# EasyEDA Pro project 小方开源v1.0(硬件设计佳立创EDA专业版).epro

# Schematic 小方-type-c-328p_开源
Create Date: 2023-09-03; Page Name: 小方开源; Project Name: 小方开源; Schematic Name: 小方-type-c-328p_开源; Update Date: 2023-09-03; Company: 嘉立创EDA; Page Size: A4; Version: V1.0
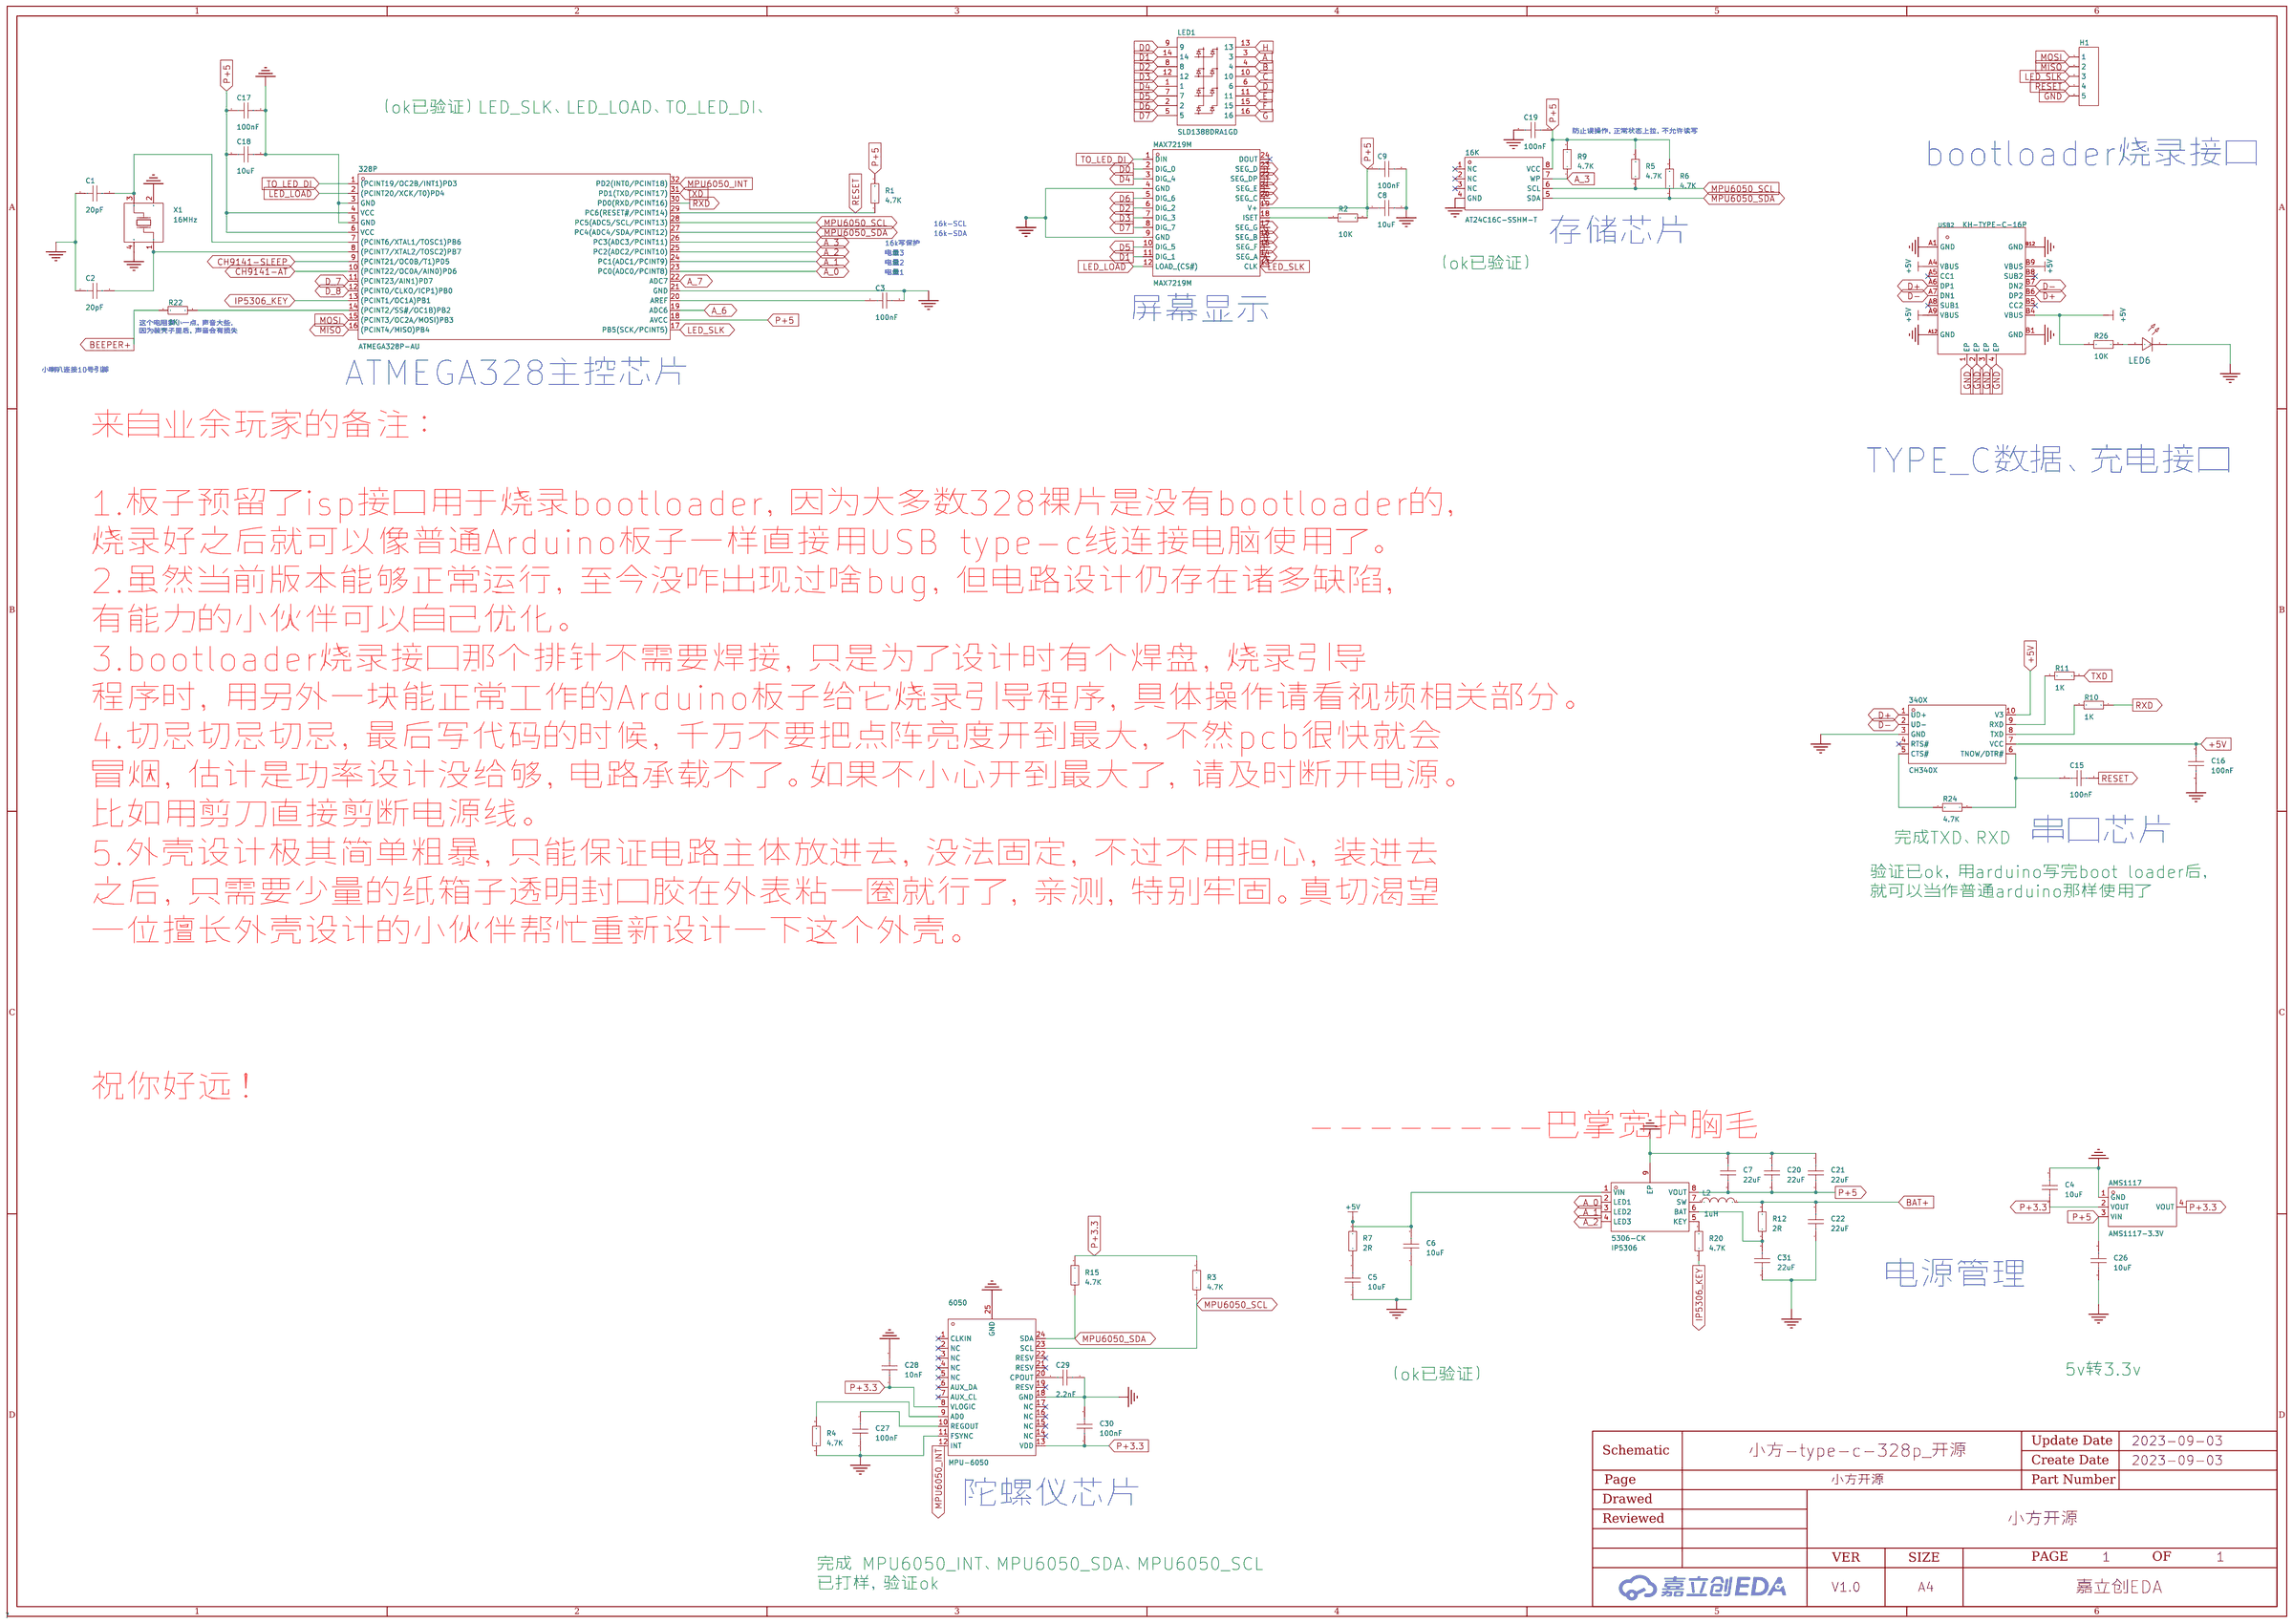
[diagram p0: schematic sheet]

## Parts
16K  AT24C16C-SSHM-T  [SOIC-8_L4.9-W3.9-P1.27-LS6.0-BL]
328P  ATMEGA328P-AU  [TQFP-32_L7.0-W7.0-P0.80-LS9.0-BL]
340X  CH340X  [MSOP-10_L3.0-W3.0-P0.50-LS5.0-BL]
5306-CK  IP5306  [ESOP-8_L4.9-W3.9-P1.27-LS6.0-BL-EP]
6050  MPU-6050  [QFN-24_L4.0-W4.0-P0.50-BL-EP2.7]
AMS1117  AMS1117-3.3V  [SOT-223_L6.5-W3.5-P2.30-LS7.0-BR]
C1  20pF  [C0603]
C2  20pF  [C0603]
C3  100nF  [C0603]
C4  10uF  [C0603]
C5  10uF  [C0603]
C6  10uF  [C0603]
C7  22uF  [C0603]
C8  10uF  [C0603]
C9  100nF  [C0603]
C15  100nF  [C0603]
C16  100nF  [C0603]
C17  100nF  [C0603]
C18  10uF  [C0603]
C19  100nF  [C0603]
C20  22uF  [C0603]
C21  22uF  [C0603]
C22  22uF  [C0603]
C26  10uF  [C0603]
C27  100nF  [C0603]
C28  10nF  [C0603]
C29  2.2nF  [C0603]
C30  100nF  [C0603]
C31  22uF  [C0603]
H1  -  [HDR-TH_5P-P2.54-V-F]
L2  1uH  [L0603]
LED1  SLD1388DRA1GD  [LED-TH_SLD1388DRA1GD]
LED6  -  [LED_0603]
MAX7219M  MAX7219M  [SOP-24_L15.2-W7.8-P1.27-LS10.6-BL]
R1  4.7K  [R0603]
R2  10K  [R0603]
R3  4.7K  [R0603]
R4  4.7K  [R0603]
R5  4.7K  [R0603]
R6  4.7K  [R0603]
R7  2R  [R0603]
R9  4.7K  [R0603]
R10  1K  [R0603]
R11  1K  [R0603]
R12  2R  [R0603]
R15  4.7K  [R0603]
R20  4.7K  [R0603]
R22  1K  [R0603]
R24  4.7K  [R0603]
R26  10K  [R0603]
USB2  KH-TYPE-C-16P  [USB-C-SMD_KH-TYPE-C-16P]
X1  16MHz  [OSC-SMD_4P-L3.2-W2.5-BL]

## Library data of the parts
16K = AT24C16C-SSHM-T: The Microchip AT24C16C is a 16Kb Serial EEPROM utilizing an  I2C ?(2-wire) serial interface. The device is organized as one block of 2K x 8 and is optimized for use in consumer, industrial, and automotive applications  where reliable and dependable nonvol; Supplier Part: C6480; Manufacturer: MICROCHIP(美国微芯); Supplier Footprint: SOIC-8-150mil; JLCPCB Part Class: Extended Part; Datasheet: https://atta.szlcsc.com/upload/public/pdf/source/20140724/1457707164884.pdf; Supplier: LCSC; Check: true
328P = ATMEGA328P-AU_C3225551: Supplier Part: C3225551; Manufacturer: MICROCHIP(美国微芯); Supplier Footprint: TQFP-32(7x7); JLCPCB Part Class: Extended Part; Supplier: LCSC; Check: true
340X = CH340X: Supplier Part: C3035748; Manufacturer: WCH(南京沁恒); Supplier Footprint: MSOP-10; JLCPCB Part Class: Extended Part; Datasheet: https://atta.szlcsc.comnull; Supplier: LCSC
5306-CK = IP5306: 2.1A充电2.4A放电高集成度移动电源SOC; Supplier Part: C181692; Manufacturer: INJOINIC(英集芯); Supplier Footprint: ESOP-8; JLCPCB Part Class: Extended Part; Datasheet: https://atta.szlcsc.com/upload/public/pdf/source/20180920/C181692_842C9BF636DF123BB66E91FC1AD6F13F.pdf; Supplier: LCSC
6050 = MPU-6050: 三轴加速度计和三轴陀螺仪，工作电压：2.375V~3.46V; Supplier Part: C24112; Manufacturer: TDK InvenSense(应美盛); Supplier Footprint: QFN-24(4x4); JLCPCB Part Class: Basic Part; Datasheet: https://atta.szlcsc.com/upload/public/pdf/source/20140425/1457707046159.pdf; Supplier: LCSC
AMS1117 = AMS1117-3.3V_C173386: 输出类型:固定;输出极性:正;输出通道数:1;最大输入电压:12V;输出电压:3.3V;压差:1.5V@(700mA);输出电流:800mA;电源纹波抑制比(PSRR):75dB@(10kHz);; LCSC Part Name: Vin=12V Vout=3.3V 800mA 75dB@(10kHz) (SC1117-3.3V); Supplier Part: C173386; Manufacturer: FM(富满); Supplier Footprint: SOT-223; JLCPCB Part Class: Extended Part; Datasheet: https://atta.szlcsc.com/upload/public/pdf/source/20210907/23798E78E2C123AD334161AB3B5C895E.pdf; Supplier: LCSC; Output Type: 固定; Output Polarity: 正; Number of Outputs: 1; Maximum Input Voltage: 12V; Output Voltage: 3.3V; Dropout Voltage: 1.5V@(700mA); Output Current: 800mA; Power Supply Rejection Ratio (PSRR): 75dB@(10kHz)
C1-C3 = CAP_0603: Supplier Footprint: 0603; Check: true
C4-C9 C15-C22 C26-C31 = CAP_0603: Supplier Footprint: 0603
H1 = HDR-F_2.54_1x5P: Supplier Part: C50950; Supplier Footprint: 插件
L2 = L_0603
LED1 = SLD1388DRA1GD_C2913075: 位数:8x8;发光颜色:红色;极性:共阳;; LCSC Part Name: 8*8mm,红光,共阳LED点阵数码管,插件; Supplier Part: C2913075; Manufacturer: SUNLIGHT(光华); Supplier Footprint: 插件; JLCPCB Part Class: Extended Part; Datasheet: https://atta.szlcsc.com/upload/public/pdf/source/20180608/C225991_CE8A1D71268437AD8DFF1F8467A765B7.pdf; Supplier: LCSC; Dot Matrix Number: 8x8; Emitting Color: 红色; Polarity: 共阳
LED6 = LED_0603-R: Supplier Footprint: 0603
MAX7219M = MAX7219M: Supplier Part: C492110; Manufacturer: HGSEMI(华冠); Supplier Footprint: SOP-24-300mil; JLCPCB Part Class: Extended Part; Datasheet: https://atta.szlcsc.com/upload/public/pdf/source/20200309/C492110_83BE5F1043010F478F6EFCE5853BF374.pdf; Supplier: LCSC
R1 R5 R6 R9 R20 = Res_0603: Supplier Footprint: 0603; Check: true
R2-R4 R7 R10-R12 R15 R22 R24 R26 = Res_0603: Supplier Footprint: 0603
USB2 = KH-TYPE-C-16P: Type-C母座 16PIN 立式四角贴板无压片; LCSC Part Name: Type-C母座; Supplier Part: C709357; Manufacturer: kinghelm(金航标); JLCPCB Part Class: 扩展库; Supplier: LCSC
X1 = X322516MLB4SI: 晶振类型:贴片无源晶振;频率:16MHz;频率公差:±10ppm;频率稳定度:±30ppm;负载电容:9pF;工作温度:-40℃~+85℃;; LCSC Part Name: YSX321SL 16MHz ±10ppm 9pF; Supplier Part: C13738; Manufacturer: YXC(扬兴晶振); Supplier Footprint: SMD3225-4P; JLCPCB Part Class: Basic Part; Datasheet: https://atta.szlcsc.com/upload/public/pdf/source/20210329/C112971_1F611BDC486E193C1706F6D8EB5AA189.pdf; Supplier: LCSC; Crystal Type: 贴片无源晶振; Frequency Tolerance: ±10ppm; Frequency Stability: ±30ppm; Load Capacitance: 9pF; Operating Temperature: -40℃~+85℃; Check: true

## Nets
+5V: 340X.7(VCC) 340X.10(V3) 5306-CK.1(VIN) C6.2 C16.2 R7.2 R26.1 USB2.A4(VBUS) USB2.A9(VBUS) USB2.B4(VBUS) USB2.B9(VBUS)
GND: 16K.4(GND) 328P.3(GND) 328P.5(GND) 328P.21(GND) 340X.3(GND) 5306-CK.9(EP) 6050.11(FSYNC) 6050.18(GND) 6050.25(GND) AMS1117.1(GND) C1.1 C2.1 C3.2 C4.2 C5.1 C6.1 C7.2 C8.2 C9.2 C16.1 C17.2 C18.2 C19.1 C20.2 C21.2 C22.1 C26.1 C27.1 C28.2 C29.2 C30.2 C31.1 H1.5 LED6.1(C) MAX7219M.4(GND) MAX7219M.9(GND) R4.1 USB2.1(EP) USB2.2(EP) USB2.3(EP) USB2.4(EP) USB2.A1(GND) USB2.A12(GND) USB2.B1(GND) USB2.B12(GND) X1.2(GND) X1.4(GND)
A: LED1.3 MAX7219M.14(SEG A)
A_0: 328P.23(PC0(ADC0/PCINT8)) 5306-CK.2(LED1)
A_1: 328P.24(PC1(ADC1/PCINT9)) 5306-CK.3(LED2)
A_2: 328P.25(PC2(ADC2/PCINT10)) 5306-CK.4(LED3)
A_3: 16K.7(WP) 328P.26(PC3(ADC3/PCINT11)) R9.1
A_6: 328P.19(ADC6)
A_7: 328P.22(ADC7)
B: LED1.4 MAX7219M.16(SEG B)
BAT+: C22.2 L2.2 R12.2
BEEPER+: R22.1
C: LED1.10 MAX7219M.20(SEG C)
CH9141-AT: 328P.10((PCINT22/OC0A/AIN0)PD6)
CH9141-SLEEP: 328P.9((PCINT21/OC0B/T1)PD5)
D: LED1.6 MAX7219M.23(SEG D)
D0: LED1.9 MAX7219M.2(DIG 0)
D1: LED1.14 MAX7219M.11(DIG 1)
D2: LED1.8 MAX7219M.6(DIG 2)
D3: LED1.12 MAX7219M.7(DIG 3)
D4: LED1.1 MAX7219M.3(DIG 4)
D5: LED1.7 MAX7219M.10(DIG 5)
D6: LED1.2 MAX7219M.5(DIG 6)
D7: LED1.5 MAX7219M.8(DIG 7)
D+: 340X.1(UD+) USB2.A6(DP1) USB2.B6(DP2)
D-: 340X.2(UD-) USB2.A7(DN1) USB2.B7(DN2)
D_7: 328P.11((PCINT23/AIN1)PD7)
D_8: 328P.12((PCINT0/CLKO/ICP1)PB0)
E: LED1.11 MAX7219M.21(SEG E)
F: LED1.15 MAX7219M.15(SEG F)
G: LED1.16 MAX7219M.17(SEG G)
H: LED1.13 MAX7219M.22(SEG DP)
IP5306_KEY: 328P.13((PCINT1/OC1A)PB1) R20.1
LED_LOAD: 328P.2((PCINT20/XCK/T0)PD4) MAX7219M.12(LOAD (CS#))
LED_SLK: 328P.17(PB5(SCK/PCINT5)) H1.3 MAX7219M.13(CLK)
MISO: 328P.16((PCINT4/MISO)PB4) H1.2
MOSI: 328P.15((PCINT3/OC2A/MOSI)PB3) H1.1
MPU6050_INT: 328P.32(PD2(INT0/PCINT18)) 6050.12(INT)
MPU6050_SCL: 16K.6(SCL) 328P.28(PC5(ADC5/SCL/PCINT13)) 6050.23(SCL) R3.1 R5.1
MPU6050_SDA: 16K.5(SDA) 328P.27(PC4(ADC4/SDA/PCINT12)) 6050.24(SDA) R6.1 R15.1
P+3.3: 6050.8(VLOGIC) 6050.13(VDD) AMS1117.2(VOUT) AMS1117.4(VOUT) C4.1 C28.1 C30.1 R3.2 R15.2
P+5: 16K.8(VCC) 328P.4(VCC) 328P.6(VCC) 328P.18(AVCC) 5306-CK.8(VOUT) AMS1117.3(VIN) C7.1 C8.1 C9.1 C17.1 C18.1 C19.2 C20.1 C21.1 C26.2 MAX7219M.19(V+) R1.2 R2.2 R5.2 R6.2 R9.2
RESET: 328P.29(PC6(RESET#/PCINT14)) C15.2 H1.4 R1.1
RXD: 328P.30(PD0(RXD/PCINT16)) R10.1
TO_LED_DI: 328P.1((PCINT19/OC2B/INT1)PD3) MAX7219M.1(DIN)
TXD: 328P.31(PD1(TXD/PCINT17)) R11.1
$1N3199: MAX7219M.18(ISET) R2.1
$1N8943: 328P.7((PCINT6/XTAL1/TOSC1)PB6) C1.2 X1.3(OSC2)
$1N8944: 328P.8((PCINT7/XTAL2/TOSC2)PB7) C2.2 X1.1(OSC1)
$1N15307: 328P.20(AREF) C3.1
$1N19611: 6050.10(REGOUT) C27.2
$1N20520: 6050.9(AD0) R4.2
$1N22481: 6050.20(CPOUT) C29.1
$1N27738: 5306-CK.6(BAT) C31.2 R12.1
$1N27741: C5.2 R7.1
$1N27755: 5306-CK.5(KEY) R20.2
$1N57623: 5306-CK.7(SW) L2.1
$1N64402: 328P.14((PCINT2/SS#/OC1B)PB2) R22.2
$1N66761: 340X.5(CTS#) R24.1
$1N66762: 340X.6(TNOW/DTR#) C15.1 R24.2
$1N66763: 340X.9(RXD) R11.2
$1N66764: 340X.8(TXD) R10.2
$1N73827: LED6.2(A) R26.2

Not connected (* = marked no-connect by the designer): 16K 1(NC)* 2(NC)* 3(NC)*; 340X 4(RTS#)*; 6050 1(CLKIN)* 2(NC)* 3(NC)* 4(NC)* 5(NC)* 6(AUX_DA)* 7(AUX_CL)* 14(NC)* 15(NC)* 16(NC)* 17(NC)* 19(RESV)* 21(RESV)* 22(RESV)*; MAX7219M 24(DOUT)*; USB2 A5(CC1)* A8(SUB1)* B5(CC2)* B8(SUB2)*

## Notes on the sheet
- （ok已验证）LED_SLK、LED_LOAD、TO_LED_DI、
- 防止误操作，正常状态上拉，不允许读写
- bootloader烧录接口
- 16k-SCL
- 16k-SDA
- 16k写保护
- 存储芯片
- 电量3
- 电量2
- （ok已验证）
- 电量1
- 屏幕显示
- 这个电阻换小一点，声音大些，
  因为装壳子里后，声音会有损失
- 小喇叭连接10号引脚
- ATMEGA328主控芯片
- 来自业余玩家的备注：
  1.板子预留了isp接口用于烧录bootloader，因为大多数328裸片是没有bootloader的，
  烧录好之后就可以像普通Arduino板子一样直接用USB type-c线连接电脑使用了。
  2.虽然当前版本能够正常运行，至今没咋出现过啥bug，但电路设计仍存在诸多缺陷，
  有能力的小伙伴可以自己优化。
  3.bootloader烧录接口那个排针不需要焊接，只是为了设计时有个焊盘，烧录引导
  程序时，用另外一块能正常工作的Arduino板子给它烧录引导程序，具体操作请看视频相关部分。
  4.切忌切忌切忌，最后写代码的时候，千万不要把点阵亮度开到最大，不然pcb很快就会
  冒烟，估计是功率设计没给够，电路承载不了。如果不小心开到最大了，请及时断开电源。
  比如用剪刀直接剪断电源线。
  5.外壳设计极其简单粗暴，只能保证电路主体放进去，没法固定，不过不用担心，装进去
  之后，只需要少量的纸箱子透明封口胶在外表粘一圈就行了，亲测，特别牢固。真切渴望
  一位擅长外壳设计的小伙伴帮忙重新设计一下这个外壳。
  祝你好远！
                                                                    --------巴掌宽护胸毛
- TYPE_C数据、充电接口
- 完成TXD、RXD
- 串口芯片
- 验证已ok，用arduino写完boot loader后，
  就可以当作普通arduino那样使用了
- 电源管理
- 5v转3.3v
- （ok已验证）
- 陀螺仪芯片
- 完成 MPU6050_INT、MPU6050_SDA、MPU6050_SCL
  已打样，验证ok

# Board 小方开源
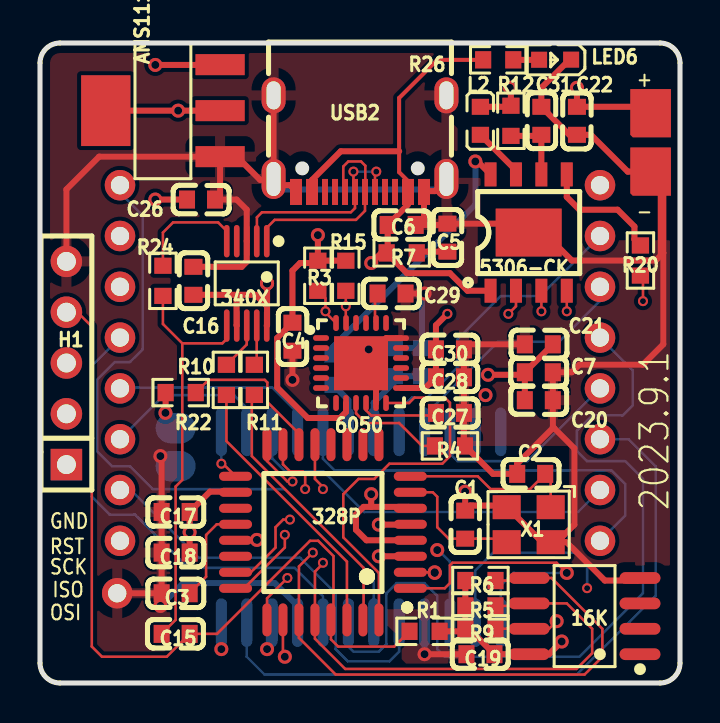
[diagram p1: board, top side]
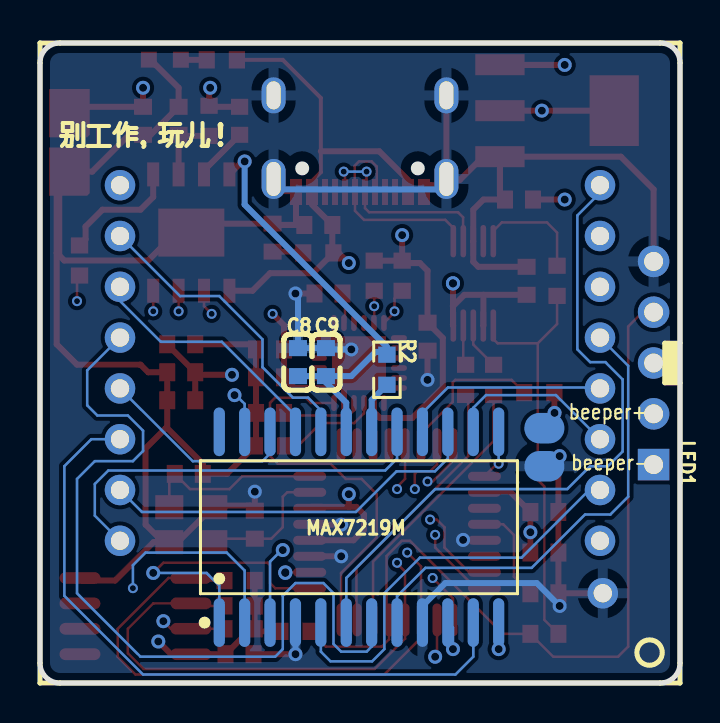
[diagram p2: board, bottom side, seen from below]

Outline 32 x 32 mm; copper layers: Top Layer, Inner1, Inner2, Bottom Layer. Coordinates in mm from the lower left corner of the outline.
Outline path: 0,31 0,1 arc(0.29,0.29) 1,0 31,0 arc(31.71,0.29) 32,1 32,31 arc(31.71,31.71) 31,32 1,32 arc(0.29,31.71) 0,31
Stack: Top Layer 0.035mm / Dielectric1 0.48mm PP er 4.5 / Inner1 0.035mm / Dielectric2 0.48mm FR4 er 4.5 / Inner2 0.035mm / Dielectric3 0.48mm PP er 4.5 / Bottom Layer 0.035mm

## Design rules (mm)
spacing safeClearance (default): track to track 0.152, other pairs 0.152 to 0.3
track width trackWidth (default): min 0.127, default 0.254, max 2.54
differential pair differentialPair (default): width min 0.127, default 0.254, max 2.54; gap min 0.152, default 0.152
via viaSize (default): diameter min 0.5, default 0.61, max 10; hole min 0.3, default 0.305, max 6

## Placement (name value [footprint] x y rotation side)
16K  AT24C16C-SSHM-T  [SOIC-8_L4.9-W3.9-P1.27-LS6.0-BL]  27.23 3.34 90 top
328P  ATMEGA328P-AU  [TQFP-32_L7.0-W7.0-P0.80-LS9.0-BL]  14.15 7.54 90 top
340X  CH340X  [MSOP-10_L3.0-W3.0-P0.50-LS5.0-BL]  10.34 19.98 180 top
5306-CK  IP5306  [ESOP-8_L4.9-W3.9-P1.27-LS6.0-BL-EP]  24.43 22.52 0 top
6050  MPU-6050  [QFN-24_L4.0-W4.0-P0.50-BL-EP2.7]  16.05 16 270 top
AMS1117  AMS1117-3.3V  [SOT-223_L6.5-W3.5-P2.30-LS7.0-BR]  6.15 28.62 0 top
C1  20pF  [C0603]  21.26 7.92 270 top
C2  20pF  [C0603]  24.56 10.46 0 top
C3  100nF  [C0603]  6.78 4.49 180 top
C4  10uF  [C0603]  12.62 17.32 270 top
C5  10uF  [C0603]  20.37 22.27 270 top
C6  10uF  [C0603]  18.08 22.9 180 top
C7  22uF  [C0603]  24.94 15.54 0 top
C8  10uF  [C0603]  19.1 16.05 90 bottom
C9  100nF  [C0603]  17.7 16.05 90 bottom
C15  100nF  [C0603]  6.78 2.46 0 top
C16  100nF  [C0603]  7.67 20.11 270 top
C17  100nF  [C0603]  6.78 8.55 180 top
C18  10uF  [C0603]  6.78 6.52 180 top
C19  100nF  [C0603]  22.02 1.44 0 top
C20  22uF  [C0603]  24.94 14.14 0 top
C21  22uF  [C0603]  24.94 16.93 180 top
C22  22uF  [C0603]  26.85 28.11 90 top
C26  10uF  [C0603]  8.05 24.17 180 top
C27  100nF  [C0603]  20.5 13.51 180 top
C28  10nF  [C0603]  20.5 15.28 0 top
C29  2.2nF  [C0603]  17.58 19.47 0 top
C30  100nF  [C0603]  20.5 16.68 0 top
C31  22uF  [C0603]  25.07 28.11 270 top
H1  -  [hdr-th_5p-p2.54-v-f]  1.32 16 90 top
L2  1uH  [L0603]  22.02 28.11 90 top
LED1  SLD1388DRA1GD  [LED-TH_SLD1388DRA1GD]  16 16 90 bottom
LED6  -  [LED_0603]  25.7 31.16 180 top
MAX7219M  MAX7219M  [SOP-24_L15.2-W7.8-P1.27-LS10.6-BL]  16.05 7.79 180 bottom
NOREF  -  [Pad_e1901]  30.53 25.57 0 top
NOREF#2  -  [Pad_e98]  6.78 12.74 0 top
NOREF#3  -  [Pad_e1123]  3.86 4.49 0 top
NOREF#4  -  [Pad_e103]  6.78 10.84 0 top
NOREF#5  -  [Pad_e1908]  30.53 28.49 0 top
R1  4.7K  [R0603]  19.23 2.58 0 top
R2  10K  [R0603]  14.66 15.66 90 bottom
R3  4.7K  [R0603]  15.29 20.36 90 top
R4  4.7K  [R0603]  20.5 11.85 180 top
R5  4.7K  [R0603]  22.02 3.85 180 top
R6  4.7K  [R0603]  22.02 5.12 180 top
R7  2R  [R0603]  18.08 21.51 180 top
R9  4.7K  [R0603]  22.02 2.71 180 top
R10  1K  [R0603]  9.32 15.16 90 top
R11  1K  [R0603]  10.72 15.16 90 top
R12  2R  [R0603]  23.54 28.11 90 top
R15  4.7K  [R0603]  13.89 20.36 90 top
R20  4.7K  [R0603]  30.02 21.12 90 top
R22  1K  [R0603]  7.03 14.52 0 top
R24  4.7K  [R0603]  6.15 20.11 270 top
R26  10K  [R0603]  22.91 31.16 0 top
USB2  KH-TYPE-C-16P  [USB-C-SMD_KH-TYPE-C-16P]  16 26.97 180 top
X1  16MHz  [OSC-SMD_4P-L3.2-W2.5-BL]  24.43 7.92 180 top

## Footprints (pads in the part's own frame, mm; a bottom-side part is the same pattern mirrored in y, then rotated)
C0603
  rect 0.8x0.9 smd: 1(-0.7,0) 2(0.7,0)
ESOP-8_L4.9-W3.9-P1.27-LS6.0-BL-EP
  rect 0.6x1.2 smd: 1(-1.905,-2.909) 2(-0.635,-2.909) 3(0.635,-2.909) 4(1.905,-2.909) 5(1.905,2.909) 6(0.635,2.909) 7(-0.635,2.909) 8(-1.905,2.909)
  rect 3.3x2.4 smd: 9(0,0)
hdr-th_5p-p2.54-v-f
  rect 1.575x1.575 hole 0.945: 1(-5.08,0)
  round 1.575 hole 0.945: 2(-2.54,0) 3(0,0) 4(2.54,0) 5(5.08,0)
L0603
  rect 0.8x0.864 smd: 1(-0.7,0) 2(0.7,0)
LED-TH_SLD1388DRA1GD
  round 1.524 hole 0.914: 1(-8.89,-12) 2(-6.35,-12) 3(-3.81,-12) 4(-1.27,-12) 5(1.27,-12) 6(3.81,-12) 7(6.35,-12) 8(8.89,-12) 9(8.89,12) 10(6.35,12) 11(3.81,12) 12(1.27,12) 13(-1.27,12) 14(-3.81,12) 15(-6.35,12) 16(-8.89,12)
LED_0603
  rect 0.8x0.8 smd: 1(-0.851,-0.01) 2(0.75,-0.005)
MSOP-10_L3.0-W3.0-P0.50-LS5.0-BL
  oval 0.28x1.62 smd: 1(-1,-2.11) 2(-0.5,-2.11) 3(0,-2.11) 4(0.5,-2.11) 5(1,-2.11) 6(1,2.11) 7(0.5,2.11) 8(0,2.11) 9(-0.5,2.11) 10(-1,2.11)
OSC-SMD_4P-L3.2-W2.5-BL
  rect 1.4x1.2 smd: 1(-1.1,-0.875) 2(1.1,-0.875) 3(1.1,0.875) 4(-1.1,0.875)
Pad_e98
  oval 2x1.524 smd far side: 1(0,0)
Pad_e103
  oval 2x1.524 smd far side: 1(0,0)
Pad_e1123
  round 1.524 hole 0.914: 1(0,0)
Pad_e1901
  custom 2.032x2.413 smd: 3(0,0)
Pad_e1908
  custom 2.032x2.413 smd: 3(0,0)
QFN-24_L4.0-W4.0-P0.50-BL-EP2.7
  oval 0.28x0.8 smd: 1(-1.25,-2) 2(-0.75,-2) 3(-0.25,-2) 4(0.25,-2) 5(0.75,-2) 6(1.25,-2) 13(1.25,2) 14(0.75,2) 15(0.25,2) 16(-0.25,2) 17(-0.75,2) 18(-1.242,2)
  oval 0.8x0.28 smd: 7(2,-1.25) 8(2,-0.75) 9(2,-0.25) 10(2,0.25) 11(2,0.75) 12(2,1.25) 19(-2,1.25) 20(-2,0.75) 21(-2,0.25) 22(-2,-0.25) 23(-2,-0.75) 24(-2,-1.25)
  rect 2.7x2.7 smd: 25(0.013,0)
R0603
  rect 0.806x0.864 smd: 1(-0.753,0) 2(0.753,0)
SOIC-8_L4.9-W3.9-P1.27-LS6.0-BL
  oval 0.588x2.045 smd: 1(-1.905,-2.772) 2(-0.635,-2.772) 3(0.635,-2.772) 4(1.905,-2.772) 5(1.905,2.772) 6(0.635,2.772) 7(-0.635,2.772) 8(-1.905,2.772)
SOP-24_L15.2-W7.8-P1.27-LS10.6-BL
  oval 0.56x2.432 smd: 1(-6.985,-4.769) 2(-5.715,-4.769) 3(-4.445,-4.769) 4(-3.175,-4.769) 5(-1.905,-4.769) 6(-0.635,-4.769) 7(0.635,-4.769) 8(1.905,-4.769) 9(3.175,-4.769) 10(4.445,-4.769) 11(5.715,-4.769) 12(6.985,-4.769) 13(6.985,4.769) 14(5.715,4.769) 15(4.445,4.769) 16(3.175,4.769) 17(1.905,4.769) 18(0.635,4.769) 19(-0.635,4.769) 20(-1.905,4.769) 21(-3.175,4.769) 22(-4.445,4.769) 23(-5.715,4.769) 24(-6.985,4.769)
SOT-223_L6.5-W3.5-P2.30-LS7.0-BR
  rect 2.465x1.05 smd: 1(2.857,-2.3) 2(2.857,0) 3(2.857,2.3)
  rect 2.465x3.54 smd: 4(-2.857,0)
TQFP-32_L7.0-W7.0-P0.80-LS9.0-BL
  oval 0.45x1.65 smd: 1(-2.8,-4.369) 2(-2,-4.369) 3(-1.2,-4.369) 4(-0.4,-4.369) 5(0.4,-4.369) 6(1.2,-4.369) 7(2,-4.369) 8(2.8,-4.369) 17(2.8,4.369) 18(2,4.369) 19(1.2,4.369) 20(0.4,4.369) 21(-0.4,4.369) 22(-1.2,4.369) 23(-2,4.369) 24(-2.8,4.369)
  oval 1.65x0.45 smd: 9(4.381,-2.8) 10(4.381,-2) 11(4.381,-1.2) 12(4.381,-0.4) 13(4.381,0.4) 14(4.381,1.2) 15(4.381,2) 16(4.381,2.8) 25(-4.381,2.8) 26(-4.381,2) 27(-4.381,1.2) 28(-4.381,0.4) 29(-4.381,-0.4) 30(-4.381,-1.2) 31(-4.381,-2) 32(-4.381,-2.8)
USB-C-SMD_KH-TYPE-C-16P
  oval 1.2x2 hole 0.7x1.7: 1(-4.32,1.765) 2(4.32,1.765)
  oval 1.2x1.8 hole 0.7x1.4: 3(-4.32,-2.415) 4(4.32,-2.415)
  rect 0.3x1.3 smd: A1(-3.35,2.415) A4(-2.55,2.415) A5(-1.25,2.415) A6(-0.25,2.415) A7(0.25,2.415) A8(1.25,2.415) A9(2.55,2.415) A12(3.35,2.415) B1(3.05,2.415) B4(2.25,2.415) B5(1.75,2.415) B6(0.75,2.415) B7(-0.75,2.415) B8(-1.75,2.415) B9(-2.25,2.415) B12(-3.05,2.415)

## Nets
As in the schematic, except:
GND: 16K.4 328P.3 328P.5 328P.21 340X.3 5306-CK.9 6050.11 6050.18 6050.25 AMS1117.1 C1.1 C2.1 C3.2 C4.2 C5.1 C6.1 C7.2 C8.2 C9.2 C16.1 C17.2 C18.2 C19.1 C20.2 C21.2 C22.1 C26.1 C27.1 C28.2 C29.2 C30.2 C31.1 H1.5 LED6.1 MAX7219M.4 MAX7219M.9 NOREF.3 NOREF#3.1 NOREF#4.1 R4.1 USB2.1 USB2.2 USB2.3 USB2.4 USB2.A1 USB2.A12 USB2.B1 USB2.B12 X1.2 X1.4
BAT+: C22.2 L2.2 NOREF#5.3 R12.2
BEEPER+: NOREF#2.1 R22.1

Pads without a net: 16K 1 2 3; 340X 4; 6050 1 2 3 4 5 6 7 14 15 16 17 19 21 22; MAX7219M 24; USB2 A5 A8 B5 B8

## Via types
v1: diameter 0.7, hole 0.4, Top Layer to Bottom Layer, 34 vias
v2: diameter 0.5, hole 0.3, Top Layer to Bottom Layer, 19 vias

## Routing (per net, layer and track width the routed paths; a pad name or vN(x,y) marks a point on that pad's centre or on a via; arc(x,y) is an arc through that point)
+5V: length 39.1
  Top Layer w0.2: R26.1 19.86,31.16 17.96,29.25 17.96,25.54 18.44,25.06 18.44,24.63 18.4,24.59 18.4,23.92
  Top Layer w0.3: 13.6,24.59 13.6,25.15 15.04,26.59 17.96,26.59 ; R7.2 17.07,21.51 v1(16.56,21) ; R7.2 17.38,21.56 C6.2 18.4,23.92 ; R7.2 18.35,20.49 20.5,20.49 21.37,19.61 5306-CK.1 ; 11.35,18.84 11.35,17.89 340X.10 ; 11.35,18.84 10.78,19.41 9.83,19.41 ; 11.35,18.84 v1(11.35,19.98) ; 9.83,19.41 9.83,17.88 340X.7 ; 9.83,19.41 C16.2
  Inner1 w0.3: v1(16.56,21) 15.54,19.98 v1(11.35,19.98)
GND: length 198.5
  Top Layer w0.3: v1(6.02,11.35) 6.08,11.28 C17.2 C18.2 C3.2 ; C29.2 v1(19.23,19.47) ; 16.78,16.72 16.8,16.69 6050.11 ; 16.78,16.72 6050.25 ; 16.78,16.72 17.31,17.24 6050.18 ; 16.78,16.72 16.47,16.72 v1(16.43,16.68) ; 31.04,21.38 30.78,21.12 26.59,21.12 25.2,22.52 5306-CK.9 23.99,22.97 C5.1 20.31,22.9 19.15,22.9 ; 31.04,21.38 31.04,24.81 31.16,24.94 ; 31.04,21.38 31.16,21.51 ; 31.16,24.94 31.16,21.51 ; 31.16,24.94 NOREF.3 29.39,25.57 27.55,27.41 26.47,27.41 C31.1 25.07,29.76 26.48,31.17 LED6.1 ; C4.2 v1(12.62,15.16) ; 20.32,25.16 19.75,24.59 19.2,24.59 19.2,22.95 19.15,22.9 ; 25.84,7.04 26.32,7.04 28.24,5.12 29.87,5.12 16K.4 ; 25.84,7.04 X1.4 25.11,7.04 23.28,8.87 21.51,8.87 C1.1 v1(21.26,9.57) ; 25.84,7.04 26.72,7.92 26.72,11.73 25.7,12.75 ; v1(10.84,7.16) 9.8,7.16 328P.21 ; 25.7,12.75 25.64,12.81 C20.2 C7.2 26.59,15.54 26.97,15.92 30.15,15.92 31.16,16.93 31.16,21.51 ; 25.7,12.75 25.64,12.75 23.86,10.97 C2.1 22.65,10.46 R4.1 21.2,11.91 C27.1 C28.2 C30.2 21.45,16.93 C21.2 ; NOREF#3.1 C3.2 ; C3.2 6.08,3.92 v1(6.02,3.85) ; 328P.5 18.5,7.92 v1(16.94,7.92) ; USB2.4 USB2.2 ; C16.1 10.08,20.81 10.34,21.06 340X.3 10.34,23.67 9.83,24.17 C26.1 9,24.43 AMS1117.1 ; 19.15,22.9 C6.1 ; H1.5 1.32,24.68 2.96,26.32 AMS1117.1 ; AMS1117.1 9.84,26.32 11,25.16 11.68,25.16 11.94,24.89 12.5,24.89 12.8,24.59 ; v1(19.23,1.44) C19.1 ; 328P.3 v1(16.94,6.34)
  Inner1 w0.3: v1(19.23,19.47) 20.32,20.57 20.32,25.16 ; v1(16.94,6.34) v1(16.94,7.92) 19.61,7.92 v1(21.26,9.57) ; v1(10.84,7.16) 10.84,6.9 7.8,3.85 v1(6.02,3.85)
  Inner2 w0.3: v1(16.43,16.68) 14.91,15.16 v1(12.62,15.16) ; v1(19.23,1.44) 17.83,2.84 17.83,7.16 17.07,7.92 v1(16.94,7.92) 16.69,8.17 14.15,8.17 13.38,8.93 11.61,8.93 10.84,8.17 v1(10.84,7.16)
  Bottom Layer w0.3: NOREF#4.1 6.27,11.35 v1(6.02,11.35) ; v1(19.23,19.47) 19.1,19.35 C8.2 C9.2 17.64,16.68 v1(16.43,16.68) ; MAX7219M.9 12.88,3.85 11.73,5 7.16,5 v1(6.02,3.85) ; 20.32,25.16 19.84,24.68 12.16,24.68 11.68,25.16 ; MAX7219M.4 v1(19.23,1.44)
A: length 8.7
  Bottom Layer w0.127: MAX7219M.14 10.34,13.76 9.7,14.39 6.2,14.39 4,12.19
A_0: length 30.9
  Top Layer w0.127: v2(12.5,8.17) 12.16,8.17 11.78,7.79 11.78,6.77 10.54,5.54 328P.23 ; v2(23.42,18.46) 23.8,18.84 5306-CK.2
  Inner1 w0.127: v2(12.5,8.17) 12.76,7.91 12.76,6.71 15.1,4.36 19.86,4.36 23.42,7.92 v2(23.42,18.46)
A_1: length 31.3
  Top Layer w0.127: v2(12.24,7.41) 12.24,6.78 10.2,4.74 328P.24 ; v2(25.07,18.59) 5306-CK.3
  Inner1 w0.127: v2(25.07,18.59) 25.07,9.06 19.99,3.98 14.91,3.98 12.24,6.65 v2(12.24,7.41)
A_2: length 29.9
  Top Layer w0.127: v2(26.34,18.59) 5306-CK.4 ; v2(12.37,5.25) 11.35,4.23 11.35,3.16 328P.25
  Inner1 w0.127: v2(12.37,5.25) 14.27,3.34 20.12,3.34 26.34,9.57 v2(26.34,18.59)
A_3: length 19.4
  Top Layer w0.127: v1(25.83,3.09) 25.45,2.71 R9.1 ; v1(12.24,1.31) 12.15,1.41 328P.26
  Inner1 w0.127: v1(12.24,1.31) 18.08,1.31 19.23,2.46 25.2,2.46 v1(25.83,3.09)
B: length 10.4
  Bottom Layer w0.127: MAX7219M.16 12.88,13.51 11.61,14.78 4.04,14.78 LED1.4
BAT+: length 10.6
  Top Layer w0.3: v1(26.85,29.76) C22.2 30.21,28.81 NOREF#5.3 ; v1(23.49,29.76) 23.54,29.71 R12.2 23.49,28.81 L2.2
  Inner1 w0.3: v1(23.49,29.76) v1(26.85,29.76)
BEEPER+: length 2
  Top Layer w0.3: R22.1 6.28,13.51 v1(6.27,13.51)
  Bottom Layer w0.3: v1(6.27,13.51) 6.78,13 NOREF#2.1
C: length 15.5
  Bottom Layer w0.127: MAX7219M.20 17.96,13.63 18.59,14.27 19.35,14.27 20.88,15.79 20.88,17.19 23.04,19.35 25,19.35 28,22.35
D: length 22.8
  Inner2 w0.127: v1(22.28,14.39) 22.02,14.14 9.67,14.14 LED1.6
  Bottom Layer w0.127: MAX7219M.23 21.77,13.96 22.21,14.39 v1(22.28,14.39)
D0: length 33.5
  Inner2 w0.127: v2(27.35,4.74) 30.78,8.17 30.78,23.92 30.02,24.68 28.21,24.68 LED1.9
  Bottom Layer w0.127: MAX7219M.2 21.77,5.62 22.67,6.52 26.72,6.52 27.35,5.89 27.35,5
D1: length 34
  Bottom Layer w0.127: 28,12.19 29.43,12.19 30.78,10.84 30.78,4.36 26.85,0.42 11.23,0.42 10.34,1.31 MAX7219M.11
D2: length 33.8
  Bottom Layer w0.127: MAX7219M.6 16.69,5.25 12.24,9.7 5.64,9.7 4.5,10.84 3.61,10.84 2.87,11.57 2.87,15.18 3.73,16.05 4.5,16.05 5.13,16.68 5.13,23.38 4,24.51 LED1.8
D3: length 41.3
  Bottom Layer w0.127: 28,17.27 29.64,15.63 29.64,13.89 29.13,13.38 27.61,13.38 26.85,12.62 26.85,11.6 27.35,11.09 29.26,11.09 30.15,10.2 30.15,4.49 26.97,1.31 20.24,1.31 19.86,1.69 19.86,4.36 19.23,5 17.83,5 17.32,4.49 17.32,1.95 16.94,1.57 15.67,1.57 15.42,1.82 MAX7219M.7
D4: length 34.1
  Inner2 w0.127: LED1.1 2.46,5.57 2.46,2.71 4.75,0.42 19.99,0.42 20.5,0.93 20.5,6.01 v1(19.86,6.65)
  Bottom Layer w0.127: MAX7219M.3 20.5,6.07 19.92,6.65 v1(19.86,6.65)
D5: length 27.2
  Inner2 w0.127: v1(11.35,1.69) 11.23,1.57 10.97,1.57 5.13,7.41 5.13,17.82 4.24,18.71 3.1,18.71 2.84,18.97 2.84,20.87 4,22.03 4,22.35
  Bottom Layer w0.127: v1(11.35,1.69) 11.35,2.77 MAX7219M.10
D6: length 20.8
  Bottom Layer w0.127: MAX7219M.5 17.96,1.57 17.47,1.08 15.39,1.08 14.78,1.69 14.78,4.49 13,6.27 7.92,6.27 4.54,9.65 LED1.2
D7: length 23.5
  Bottom Layer w0.127: MAX7219M.8 14.15,4.34 12.73,5.76 7.42,5.76 4.75,8.43 3.48,8.43 2.59,9.31 2.59,15.86 4,17.27
D+: length 10.8
  Top Layer w0.127: 15.25,24.59 15.16,24.68 15.16,25.82 15.42,26.08 16.05,26.08 16.27,25.86 16.27,24.61 16.25,24.59 16.25,23.61 15.8,23.16 11.73,23.16 11.34,22.76 340X.1
D-: length 10.3
  Top Layer w0.127: 16.75,24.59 16.75,25.51 v2(16.81,25.57) ; 340X.2 10.84,22.1 10.84,23.28 11.1,23.54 15.54,23.54 15.75,23.74 15.75,24.59 15.67,24.67 v2(15.67,25.57)
  Bottom Layer w0.127: v2(15.67,25.57) v2(16.81,25.57)
E: length 12.7
  Bottom Layer w0.127: MAX7219M.21 19.23,13.38 22.91,17.06 25.96,17.06 28,19.1 LED1.11
F: length 19.3
  Bottom Layer w0.127: MAX7219M.15 11.61,11.23 12.25,10.58 14.17,10.58 16.2,8.55 26.9,8.55 LED1.15
G: length 20.3
  Bottom Layer w0.127: MAX7219M.17 14.15,11.22 14.74,10.63 28.58,10.63 29.26,9.95 29.26,8.37 LED1.16
H: length 10.3
  Bottom Layer w0.127: LED1.13 24.36,11.09 20.88,11.09 20.5,11.47 MAX7219M.22
IP5306_KEY: length 30.2
  Top Layer w0.127: R20.1 30.15,20.24 v2(30.15,19.09) ; v2(14.15,9.7) 14.15,9.8 13.75,10.2 328P.13
  Inner2 w0.127: v2(30.15,19.09) 30.15,9.44 29.26,8.55 15.29,8.55 v2(14.15,9.7)
LED_LOAD: length 17.1
  Top Layer w0.127: 328P.2 v1(19.74,5.54)
  Inner2 w0.127: 9.07,1.44 9.76,0.75 19.55,0.75 19.99,1.19 19.99,5.25 v1(19.74,5.5)
  Bottom Layer w0.127: v1(19.74,5.54) v1(19.74,5.5)
  vias: v1(9.07,1.69)
LED_SLK: length 12.7
  Top Layer w0.127: 328P.17 9.15,10.97 v2(9.07,10.97)
  Inner1 w0.127: v2(9.07,10.97) 7.42,10.97 4.88,13.51 3.35,13.51 1.45,15.41 1.45,15.87 H1.3
  Bottom Layer w0.127: MAX7219M.13 v2(9.07,10.97)
MISO: length 15.6
  Top Layer w0.127: 328P.16 11.35,11.1 12.37,10.08 v2(12.62,10.08)
  Inner1 w0.127: v2(12.62,10.08) 12.37,10.33 5.51,10.33 5,10.84 3.73,10.84 1.19,13.38 1.19,13.63
MOSI: length 17.5
  Top Layer w0.127: 328P.15 12.15,10.93 12.5,10.58 13.13,10.58 13.26,10.46 v2(13.26,9.7)
  Inner1 w0.127: v2(13.26,9.7) 13.13,9.7 11.86,8.43 2.21,8.43 1.45,9.19 1.45,10.79 H1.1
MPU6050_INT: length 19.2
  Top Layer w0.127: 6050.12 18.45,14 18.72,14.27 20.24,14.27 20.5,14.01 20.5,11.35 20.12,10.97 17.47,10.97 16.71,10.2 15.93,10.2 15.16,9.44 15.16,7.28 16.95,5.5 328P.32
MPU6050_SCL: length 40.3
  Top Layer w0.127: 6050.23 15.29,18.01 v2(15.29,18.84) R3.1 ; R5.1 24.33,3.85 16K.6 26.34,3.98 27.61,2.71 27.61,1.49 26.82,0.7 15.26,0.7 13.75,2.22 328P.28 13.75,5.57 14.15,5.97 v2(14.15,6.01)
  Inner1 w0.127: v2(14.15,6.01) 15.29,7.16 v2(15.29,18.84)
MPU6050_SDA: length 43.5
  Top Layer w0.127: R6.1 24.33,5.12 16K.5 25.58,5.25 28.12,2.71 28.12,1.31 27.23,0.42 14.78,0.42 12.95,2.26 328P.27 12.95,5.83 v2(13.64,6.52) ; R15.1 14.27,19.23 v2(14.27,18.59) 14.27,18.53 6050.24
  Inner1 w0.127: v2(14.27,18.59) 14.91,17.95 14.91,7.79 v2(13.64,6.52)
P+3.3: length 44.3
  Top Layer w0.3: v2(20.37,18.46) 19.8,17.89 C30.1 C28.1 19.26,14.75 6050.13 ; R15.2 13.77,21 13,21 12.62,20.62 C4.1 11.86,17.25 11.86,14.78 13.38,13.25 15,13.25 15.3,13.55 6050.8 ; R15.2 R3.2 ; R15.2 v1(13.89,22.4) ; AMS1117.4 v1(6.91,28.62) AMS1117.2
  Inner1 w0.3: v1(6.91,28.62) 6.91,28.12 12.63,22.4 v1(13.89,22.4)
  Inner2 w0.3: v1(13.89,22.4) 13.89,21.89 17.32,18.46 v2(20.37,18.46)
P+5: length 140.8
  Top Layer w0.3: R9.2 21.14,2.58 R1.2 ; R9.2 R5.2 R6.2 ; R9.2 21.45,2.71 C19.2 16K.8 25.45,1.44 v1(26.09,2.08) ; AMS1117.3 8.99,30.9 v1(5.77,30.9) ; C7.1 C20.1 ; C7.1 24.25,15.54 C21.1 ; C7.1 24.12,15.41 v1(22.4,15.41) ; 16.56,8.81 18.45,8.81 328P.6 ; 16.56,8.81 v1(16.56,9.44) ; 16.56,8.81 16.18,8.81 15.8,8.43 15.8,7.66 16.32,7.14 328P.4 ; 328P.18 9.75,9.57 8.5,9.57 C17.1 v1(7.48,7.54) C18.1 ; v1(5.77,24.17) C26.2 ; v1(21.77,26.08) 21.88,26.08 5306-CK.8
  Inner1 w0.3: v1(16.56,9.44) 16.56,11.85 20.12,15.41 v1(22.4,15.41) 21.77,16.05 v1(21.77,26.08) 21.13,26.71 18.47,26.71 17.7,25.95 17.7,24.43 14.66,21.38 8.56,21.38 v1(5.77,24.17) v1(5.77,30.9) ; v1(26.09,2.08) 24.56,0.55 7.03,0.55 5.13,2.46 5.13,5.19 v1(7.48,7.54)
  Inner2 w0.3: v1(7.48,7.54) 7.55,7.54 10.97,10.97 15.04,10.97 v1(16.56,9.44)
  Bottom Layer w0.3: MAX7219M.19 16.69,14.01 17.7,15.03 C9.1 ; v1(21.77,26.08) 21.77,23.92 14.66,16.81 R2.2 14.79,16.55 15.22,16.55 16.43,15.34 C9.1 ; C9.1 C8.1
RESET: length 41.2
  Top Layer w0.127: R1.1 17.71,1.82 14.91,1.82 14.55,2.18 328P.29 14.67,3.28 14.67,6.35 13.91,7.11 13.5,7.11 8.85,2.46 C15.2 6.34,1.31 3.1,1.31 2.59,1.82 2.59,17.82 1.87,18.54 H1.4
RXD: length 13.7
  Top Layer w0.127: 328P.30 15.35,6.07 9.32,12.09 R10.1
TO_LED_DI: length 14.5
  Top Layer w0.127: 328P.1 20.24,4.74 20.5,5 20.5,5.89 20.62,6.01 25.83,6.01 v1(26.34,5.5)
  Bottom Layer w0.127: v1(26.34,5.5) 23.67,5.5 23.04,4.87 MAX7219M.1
TXD: length 13.6
  Top Layer w0.127: R11.1 10.59,14.28 10.59,11.35 16.18,5.76 16.18,3.19 328P.31
$1N3199: length 2.7
  Bottom Layer w0.3: MAX7219M.18 15.42,14.15 R2.1
$1N8943: length 6.7
  Top Layer w0.127: X1.3 23.16,7.22 C1.2 20.44,7.22 19.86,7.79 19.86,9.31 19.64,9.54 328P.7
$1N8944: length 9.1
  Top Layer w0.127: X1.1 25.53,10.18 C2.2 24.5,9.7 22.53,9.7 21.89,10.34 328P.8
$1N15307: length 4.9
  Top Layer w0.127: 328P.20 8.84,7.94 8.31,7.4 8.31,5.31 C3.1
$1N19611: length 4
  Top Layer w0.127: 6050.10 16.3,13.64 16.56,13.38 19.67,13.38 C27.2
$1N20520: length 5.1
  Top Layer w0.127: 6050.9 15.8,13.49 16.29,13 17.96,13 19.1,11.85 R4.2
$1N22481: length 1.5
  Top Layer w0.127: C29.1 16.75,19.35 16.75,18.05 6050.20
$1N27738: length 3.5
  Top Layer w0.3: 5306-CK.6 25.07,27.41 25.02,27.36 R12.1
$1N27741: length 1.6
  Top Layer w0.3: R7.1 18.9,21.57 C5.2
$1N27755: length 6.2
  Top Layer w0.3: R20.2 29.72,22.18 29.72,22.82 28.88,23.67 26.97,23.67 26.34,24.3 5306-CK.5
$1N57623: length 2.7
  Top Layer w0.3: 22.02,27.41 23.8,25.63 5306-CK.7
$1N64402: length 7.7
  Top Layer w0.127: 328P.14 12.95,12.47 11.37,14.05 11.37,15.03 11.24,15.16 8.42,15.16 R22.2
$1N66761: length 5.7
  Top Layer w0.127: R24.1 6.15,22.52 6.65,23.03 8.91,23.03 9.34,22.6 340X.5
$1N66762: length 20.7
  Top Layer w0.127: 7.11,16.98 7.11,10.15 6.78,9.82 6.78,3.16 C15.1 ; 7.11,16.98 9.12,16.98 9.34,17.2 340X.6 ; 7.11,16.98 6.15,17.95 R24.2
$1N66763: length 2
  Top Layer w0.127: 340X.9 10.84,16.03 R11.2
$1N66764: length 2.4
  Top Layer w0.127: 340X.8 10.34,16.93 R10.2
$1N73827: length 1.3
  Top Layer w0.3: LED6.2 24.95,31.16 R26.2

## Copper pours and planes (outline as drawn; the poured copper is in the pictures)
GND on Top Layer: -4.65,35.35 35.1,35.35 35.1,-3.13 -4.65,-3.13
GND on Bottom Layer: -1.22,33.06 33.2,33.06 33.2,-1.23 -1.22,-1.23
GND on Inner2: -0.84,33.06 33.2,33.06 33.2,-1.23 -0.84,-1.23

## Text on the board
Bottom Silkscreen Layer: beeper- | beeper+ | 别工作，玩儿！
Top Silkscreen Layer: GND | RST | SCK | OSI | ISO | + | - | 2023.9.1
